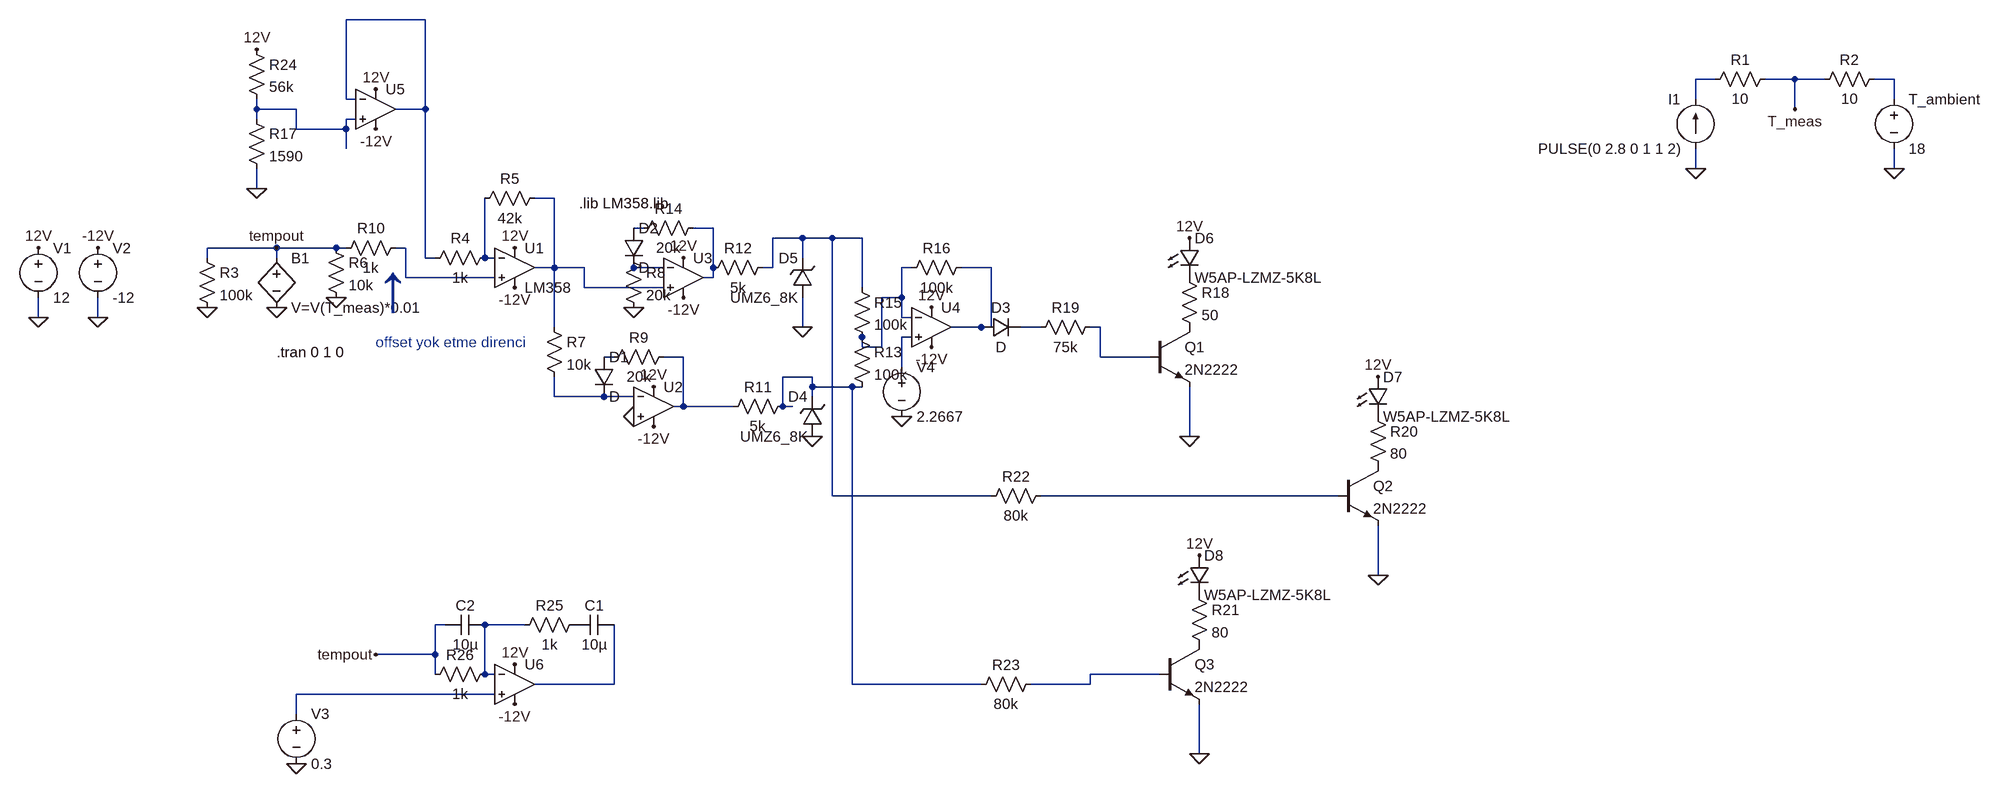
[diagram p0: schematic part-1.asc]
part-1.asc, the LTspice schematic file:
Version 4
SHEET 1 2184 1124
WIRE -336 -352 -464 -352
WIRE 1744 -256 1712 -256
WIRE 1872 -256 1824 -256
WIRE 1920 -256 1872 -256
WIRE 2032 -256 2000 -256
WIRE -464 -224 -464 -352
WIRE -448 -224 -464 -224
WIRE 1712 -224 1712 -256
WIRE 2032 -224 2032 -256
WIRE -608 -208 -608 -224
WIRE -544 -208 -608 -208
WIRE -336 -208 -336 -352
WIRE -336 -208 -384 -208
WIRE 1872 -208 1872 -256
WIRE -608 -192 -608 -208
WIRE -448 -192 -464 -192
WIRE -544 -176 -544 -208
WIRE -464 -176 -464 -192
WIRE -464 -176 -544 -176
WIRE -464 -144 -464 -176
WIRE 1712 -112 1712 -144
WIRE 2032 -112 2032 -144
WIRE -608 -80 -608 -112
WIRE -128 -64 -160 -64
WIRE 16 -16 0 -16
WIRE 128 -16 96 -16
WIRE 272 0 224 0
WIRE 320 0 272 0
WIRE 368 0 320 0
WIRE -576 16 -688 16
WIRE -480 16 -576 16
WIRE -464 16 -480 16
WIRE -368 16 -384 16
WIRE -688 32 -688 16
WIRE -576 32 -576 16
WIRE -336 32 -336 -208
WIRE -320 32 -336 32
WIRE -240 32 -240 -64
WIRE -224 32 -240 32
WIRE 272 32 272 0
WIRE -128 48 -128 -64
WIRE -128 48 -160 48
WIRE -80 48 -128 48
WIRE 0 48 0 32
WIRE 48 48 0 48
WIRE 128 48 128 -16
WIRE 224 48 224 0
WIRE 224 48 208 48
WIRE 448 48 432 48
WIRE 576 48 528 48
WIRE -368 64 -368 16
WIRE -224 64 -368 64
WIRE 128 64 128 48
WIRE 128 64 112 64
WIRE -80 80 -80 48
WIRE 48 80 -80 80
WIRE 368 80 368 0
WIRE 432 96 432 48
WIRE 432 96 400 96
WIRE -960 128 -960 96
WIRE -864 128 -864 96
WIRE 432 128 432 96
WIRE 448 128 432 128
WIRE -128 144 -128 48
WIRE 272 144 272 96
WIRE 560 144 512 144
WIRE 576 144 576 48
WIRE 576 144 560 144
WIRE 656 144 624 144
WIRE 752 144 736 144
WIRE 448 160 432 160
WIRE 368 176 368 160
WIRE 400 176 400 96
WIRE 400 176 368 176
WIRE -32 192 -48 192
WIRE 80 192 48 192
WIRE 752 192 752 144
WIRE 832 192 752 192
WIRE 432 208 432 160
WIRE 288 224 240 224
WIRE 288 240 288 224
WIRE 352 240 288 240
WIRE 368 240 352 240
WIRE -128 256 -128 224
WIRE -48 256 -128 256
WIRE 0 256 -48 256
WIRE 288 256 288 240
WIRE 80 272 80 192
WIRE 80 272 64 272
WIRE 160 272 80 272
WIRE 240 272 240 224
WIRE 256 272 240 272
WIRE 896 320 896 240
WIRE 320 416 320 0
WIRE 576 416 320 416
WIRE 1136 416 656 416
WIRE 1200 544 1200 464
WIRE -304 624 -320 624
WIRE -176 624 -240 624
WIRE -320 672 -320 624
WIRE -320 672 -416 672
WIRE -320 704 -320 672
WIRE -240 704 -240 624
WIRE -224 704 -240 704
WIRE 848 704 736 704
WIRE -32 720 -32 624
WIRE -32 720 -160 720
WIRE 352 720 352 240
WIRE 560 720 352 720
WIRE 736 720 736 704
WIRE 736 720 640 720
WIRE -224 736 -544 736
WIRE -544 768 -544 736
WIRE 912 832 912 752
FLAG 2032 -112 0
FLAG 1712 -112 0
FLAG 1872 -208 T_meas
FLAG -576 112 0
FLAG -688 112 0
FLAG -960 128 0
FLAG -960 16 12V
FLAG -864 128 0
FLAG -864 16 -12V
FLAG -192 80 -12V
FLAG -192 16 12V
FLAG -480 96 0
FLAG -608 -80 0
FLAG -608 -304 12V
FLAG 0 288 0
FLAG 32 304 -12V
FLAG 32 240 12V
FLAG 288 320 0
FLAG 272 144 0
FLAG 80 96 -12V
FLAG 80 32 12V
FLAG 0 112 0
FLAG 480 176 -12V
FLAG 480 112 12V
FLAG 432 288 0
FLAG 896 320 0
FLAG 896 0 12V
FLAG 1200 544 0
FLAG 1200 224 12V
FLAG 912 832 0
FLAG 912 512 12V
FLAG -416 -176 -12V
FLAG -416 -240 12V
FLAG -192 752 -12V
FLAG -192 688 12V
FLAG -544 848 0
FLAG -576 16 tempout
FLAG -416 672 tempout
SYMBOL voltage 2032 -240 R0
WINDOW 123 0 0 Left 0
WINDOW 39 0 0 Left 0
SYMATTR InstName T_ambient
SYMATTR Value 18
SYMBOL res 1840 -272 R90
WINDOW 0 0 56 VBottom 2
WINDOW 3 32 56 VTop 2
SYMATTR InstName R1
SYMATTR Value 10
SYMBOL res 2016 -272 R90
WINDOW 0 0 56 VBottom 2
WINDOW 3 32 56 VTop 2
SYMATTR InstName R2
SYMATTR Value 10
SYMBOL current 1712 -144 R180
WINDOW 0 24 80 Left 2
WINDOW 3 24 0 Left 2
WINDOW 123 0 0 Left 0
WINDOW 39 0 0 Left 0
SYMATTR InstName I1
SYMATTR Value PULSE(0 2.8 0 1 1 2)
SYMBOL bv -576 16 R0
SYMATTR InstName B1
SYMATTR Value V=V(T_meas)*0.01
SYMBOL res -704 16 R0
SYMATTR InstName R3
SYMATTR Value 100k
SYMBOL voltage -960 0 R0
SYMATTR InstName V1
SYMATTR Value 12
SYMBOL voltage -864 0 R0
WINDOW 123 0 0 Left 0
WINDOW 39 0 0 Left 0
SYMATTR InstName V2
SYMATTR Value -12
SYMBOL res -144 -80 R90
WINDOW 0 0 56 VBottom 2
WINDOW 3 32 56 VTop 2
SYMATTR InstName R5
SYMATTR Value 42k
SYMBOL res -224 16 R90
WINDOW 0 0 56 VBottom 2
WINDOW 3 32 56 VTop 2
SYMATTR InstName R4
SYMATTR Value 1k
SYMBOL res -496 0 R0
SYMATTR InstName R6
SYMATTR Value 10k
SYMBOL Opamps\\opamp2 -192 -16 R0
SYMATTR InstName U1
SYMATTR Value LM358
SYMBOL res -368 0 R90
WINDOW 0 0 56 VBottom 2
WINDOW 3 32 56 VTop 2
SYMATTR InstName R10
SYMATTR Value 1k
SYMBOL res -144 128 R0
SYMATTR InstName R7
SYMATTR Value 10k
SYMBOL res 64 176 R90
WINDOW 0 0 56 VBottom 2
WINDOW 3 32 56 VTop 2
SYMATTR InstName R9
SYMATTR Value 20k
SYMBOL zener 304 320 R180
WINDOW 0 24 64 Left 2
WINDOW 3 24 0 Left 2
SYMATTR InstName D4
SYMATTR Value UMZ6_8K
SYMBOL res 256 256 R90
WINDOW 0 0 56 VBottom 2
WINDOW 3 32 56 VTop 2
SYMATTR InstName R11
SYMATTR Value 5k
SYMBOL Opamps\\UniversalOpamp2 32 272 R0
SYMATTR InstName U2
SYMBOL zener 288 96 R180
WINDOW 0 24 64 Left 2
WINDOW 3 24 0 Left 2
SYMATTR InstName D5
SYMATTR Value UMZ6_8K
SYMBOL res 224 32 R90
WINDOW 0 0 56 VBottom 2
WINDOW 3 32 56 VTop 2
SYMATTR InstName R12
SYMATTR Value 5k
SYMBOL res 112 -32 R90
WINDOW 0 0 56 VBottom 2
WINDOW 3 32 56 VTop 2
SYMATTR InstName R14
SYMATTR Value 20k
SYMBOL Opamps\\UniversalOpamp2 80 64 R0
SYMATTR InstName U3
SYMBOL res -16 16 R0
SYMATTR InstName R8
SYMATTR Value 20k
SYMBOL diode -64 192 R0
SYMATTR InstName D1
SYMBOL diode -16 -16 R0
SYMATTR InstName D2
SYMBOL Opamps\\UniversalOpamp2 480 144 R0
SYMATTR InstName U4
SYMBOL res 352 144 R0
SYMATTR InstName R13
SYMATTR Value 100k
SYMBOL res 352 64 R0
SYMATTR InstName R15
SYMATTR Value 100k
SYMBOL res 544 32 R90
WINDOW 0 0 56 VBottom 2
WINDOW 3 32 56 VTop 2
SYMATTR InstName R16
SYMATTR Value 100k
SYMBOL voltage 432 192 R0
WINDOW 123 0 0 Left 0
WINDOW 39 0 0 Left 0
SYMATTR InstName V4
SYMATTR Value 2.2667
SYMBOL diode 560 160 R270
WINDOW 0 32 32 VTop 2
WINDOW 3 0 32 VBottom 2
SYMATTR InstName D3
SYMBOL npn 832 144 R0
SYMATTR InstName Q1
SYMATTR Value 2N2222
SYMBOL res 752 128 R90
WINDOW 0 0 56 VBottom 2
WINDOW 3 32 56 VTop 2
SYMATTR InstName R19
SYMATTR Value 75k
SYMBOL LED 880 0 R0
SYMATTR InstName D6
SYMATTR Value W5AP-LZMZ-5K8L
SYMATTR Description Diode
SYMATTR Type diode
SYMBOL res 880 48 R0
SYMATTR InstName R18
SYMATTR Value 50
SYMBOL npn 1136 368 R0
SYMATTR InstName Q2
SYMATTR Value 2N2222
SYMBOL LED 1184 224 R0
SYMATTR InstName D7
SYMATTR Value W5AP-LZMZ-5K8L
SYMATTR Description Diode
SYMATTR Type diode
SYMBOL res 1184 272 R0
SYMATTR InstName R20
SYMATTR Value 80
SYMBOL npn 848 656 R0
SYMATTR InstName Q3
SYMATTR Value 2N2222
SYMBOL LED 896 512 R0
SYMATTR InstName D8
SYMATTR Value W5AP-LZMZ-5K8L
SYMATTR Description Diode
SYMATTR Type diode
SYMBOL res 896 560 R0
SYMATTR InstName R21
SYMATTR Value 80
SYMBOL res 672 400 R90
WINDOW 0 0 56 VBottom 2
WINDOW 3 32 56 VTop 2
SYMATTR InstName R22
SYMATTR Value 80k
SYMBOL res 656 704 R90
WINDOW 0 0 56 VBottom 2
WINDOW 3 32 56 VTop 2
SYMATTR InstName R23
SYMATTR Value 80k
SYMBOL res -624 -208 R0
SYMATTR InstName R17
SYMATTR Value 1590
SYMBOL res -624 -320 R0
SYMATTR InstName R24
SYMATTR Value 56k
SYMBOL Opamps\\UniversalOpamp2 -416 -208 R0
SYMATTR InstName U5
SYMBOL Opamps\\UniversalOpamp2 -192 720 R0
SYMATTR InstName U6
SYMBOL res -80 608 R90
WINDOW 0 0 56 VBottom 2
WINDOW 3 32 56 VTop 2
SYMATTR InstName R25
SYMATTR Value 1k
SYMBOL cap -32 608 R90
WINDOW 0 0 32 VBottom 2
WINDOW 3 32 32 VTop 2
SYMATTR InstName C1
SYMATTR Value 10µ
SYMBOL res -224 688 R90
WINDOW 0 0 56 VBottom 2
WINDOW 3 32 56 VTop 2
SYMATTR InstName R26
SYMATTR Value 1k
SYMBOL cap -240 608 R90
WINDOW 0 0 32 VBottom 2
WINDOW 3 32 32 VTop 2
SYMATTR InstName C2
SYMATTR Value 10µ
SYMBOL voltage -544 752 R0
WINDOW 123 0 0 Left 0
WINDOW 39 0 0 Left 0
SYMATTR InstName V3
SYMATTR Value 0.3
TEXT -576 184 Left 2 !.tran 0 1 0
TEXT -88 -56 Left 2 !.lib LM358.lib
TEXT -416 168 Left 2 ;offset yok etme direnci
TEXT -416 80 Left 7 ;↑

The netlist it stands for:
* part-1.asc
V§T_ambient N003 0 18
R1 T_meas N002 10
R2 N003 T_meas 10
I1 0 N002 PULSE(0 2.8 0 1 1 2)
B1 tempout 0 V=V(T_meas)*0.01
R3 tempout 0 100k
V1 12V 0 12
V2 -12V 0 -12
R5 N005 N010 42k
R4 N010 N001 1k
R6 tempout 0 10k
XU1 N009 N010 12V -12V N005 LM358  ; pins In+ In- V+ V- OUT
R10 N009 tempout 1k
R7 N005 N020 10k
R9 N018 N017 20k
D4 0 N019 UMZ6_8K
R11 N019 N018 5k
XU2 0 N020 12V -12V N018 level.2 Avol=1Meg GBW=10Meg Slew=10Meg ilimit=25m rail=0 Vos=0 phimargin=45 en=0 enk=0 in=0 ink=0 Rin=500Meg  ; pins IN+ IN- V+ V- OUT
D5 0 N008 UMZ6_8K
R12 N008 N007 5k
R14 N007 N006 20k
XU3 N005 N011 12V -12V N007 level.2 Avol=1Meg GBW=10Meg Slew=10Meg ilimit=25m rail=0 Vos=0 phimargin=45 en=0 enk=0 in=0 ink=0 Rin=500Meg  ; pins IN+ IN- V+ V- OUT
R8 N011 0 20k
D1 N017 N020 D
D2 N006 N011 D
XU4 N016 N012 12V -12V N013 level.2 Avol=1Meg GBW=10Meg Slew=10Meg ilimit=25m rail=0 Vos=0 phimargin=45 en=0 enk=0 in=0 ink=0 Rin=500Meg  ; pins IN+ IN- V+ V- OUT
R13 N012 N019 100k
R15 N008 N012 100k
R16 N013 N012 100k
V4 N016 0 2.2667
D3 N013 N014 D
Q1 P001 N015 0 0 2N2222
R19 N015 N014 75k
D6 12V P002 W5AP-LZMZ-5K8L
R18 P002 P001 50
Q2 P003 N021 0 0 2N2222
D7 12V P004 W5AP-LZMZ-5K8L
R20 P004 P003 80
Q3 P005 N023 0 0 2N2222
D8 12V P006 W5AP-LZMZ-5K8L
R21 P006 P005 80
R22 N021 N008 80k
R23 N023 N019 80k
R17 N004 0 1590
R24 12V N004 56k
XU5 N004 N001 12V -12V N001 level.2 Avol=1Meg GBW=10Meg Slew=10Meg ilimit=25m rail=0 Vos=0 phimargin=45 en=0 enk=0 in=0 ink=0 Rin=500Meg  ; pins IN+ IN- V+ V- OUT
XU6 N025 N022 12V -12V N024 level.2 Avol=1Meg GBW=10Meg Slew=10Meg ilimit=25m rail=0 Vos=0 phimargin=45 en=0 enk=0 in=0 ink=0 Rin=500Meg  ; pins IN+ IN- V+ V- OUT
R25 P007 N022 1k
C1 N024 P007 10µ
R26 N022 tempout 1k
C2 N022 tempout 10µ
V3 N025 0 0.3
.model D D
.lib standard.dio
.model NPN NPN
.model PNP PNP
.lib standard.bjt
.tran 0 1 0
.lib LM358.lib
* offset yok etme direnci
* ↑
.lib UniversalOpamps2.sub
.backanno
.end